# EAGLE design vehicle_control_module_0.1.0 (EAGLE 8.1.1)
DESCRIPTION: microOBD 200 OBD-II Module; HW_REV: 1.4; PCB_REV: C; PCB_SPEC1: Layer Count: 4; PCB_SPEC2: Size: 1.3" x 0.59"; PCB_SPEC3: Finish Thickness: 0.049" - 0.052"; PCB_SPEC4: Copper Weight: 1oz; TITLE: STM1120

## Sheet 1 of 2
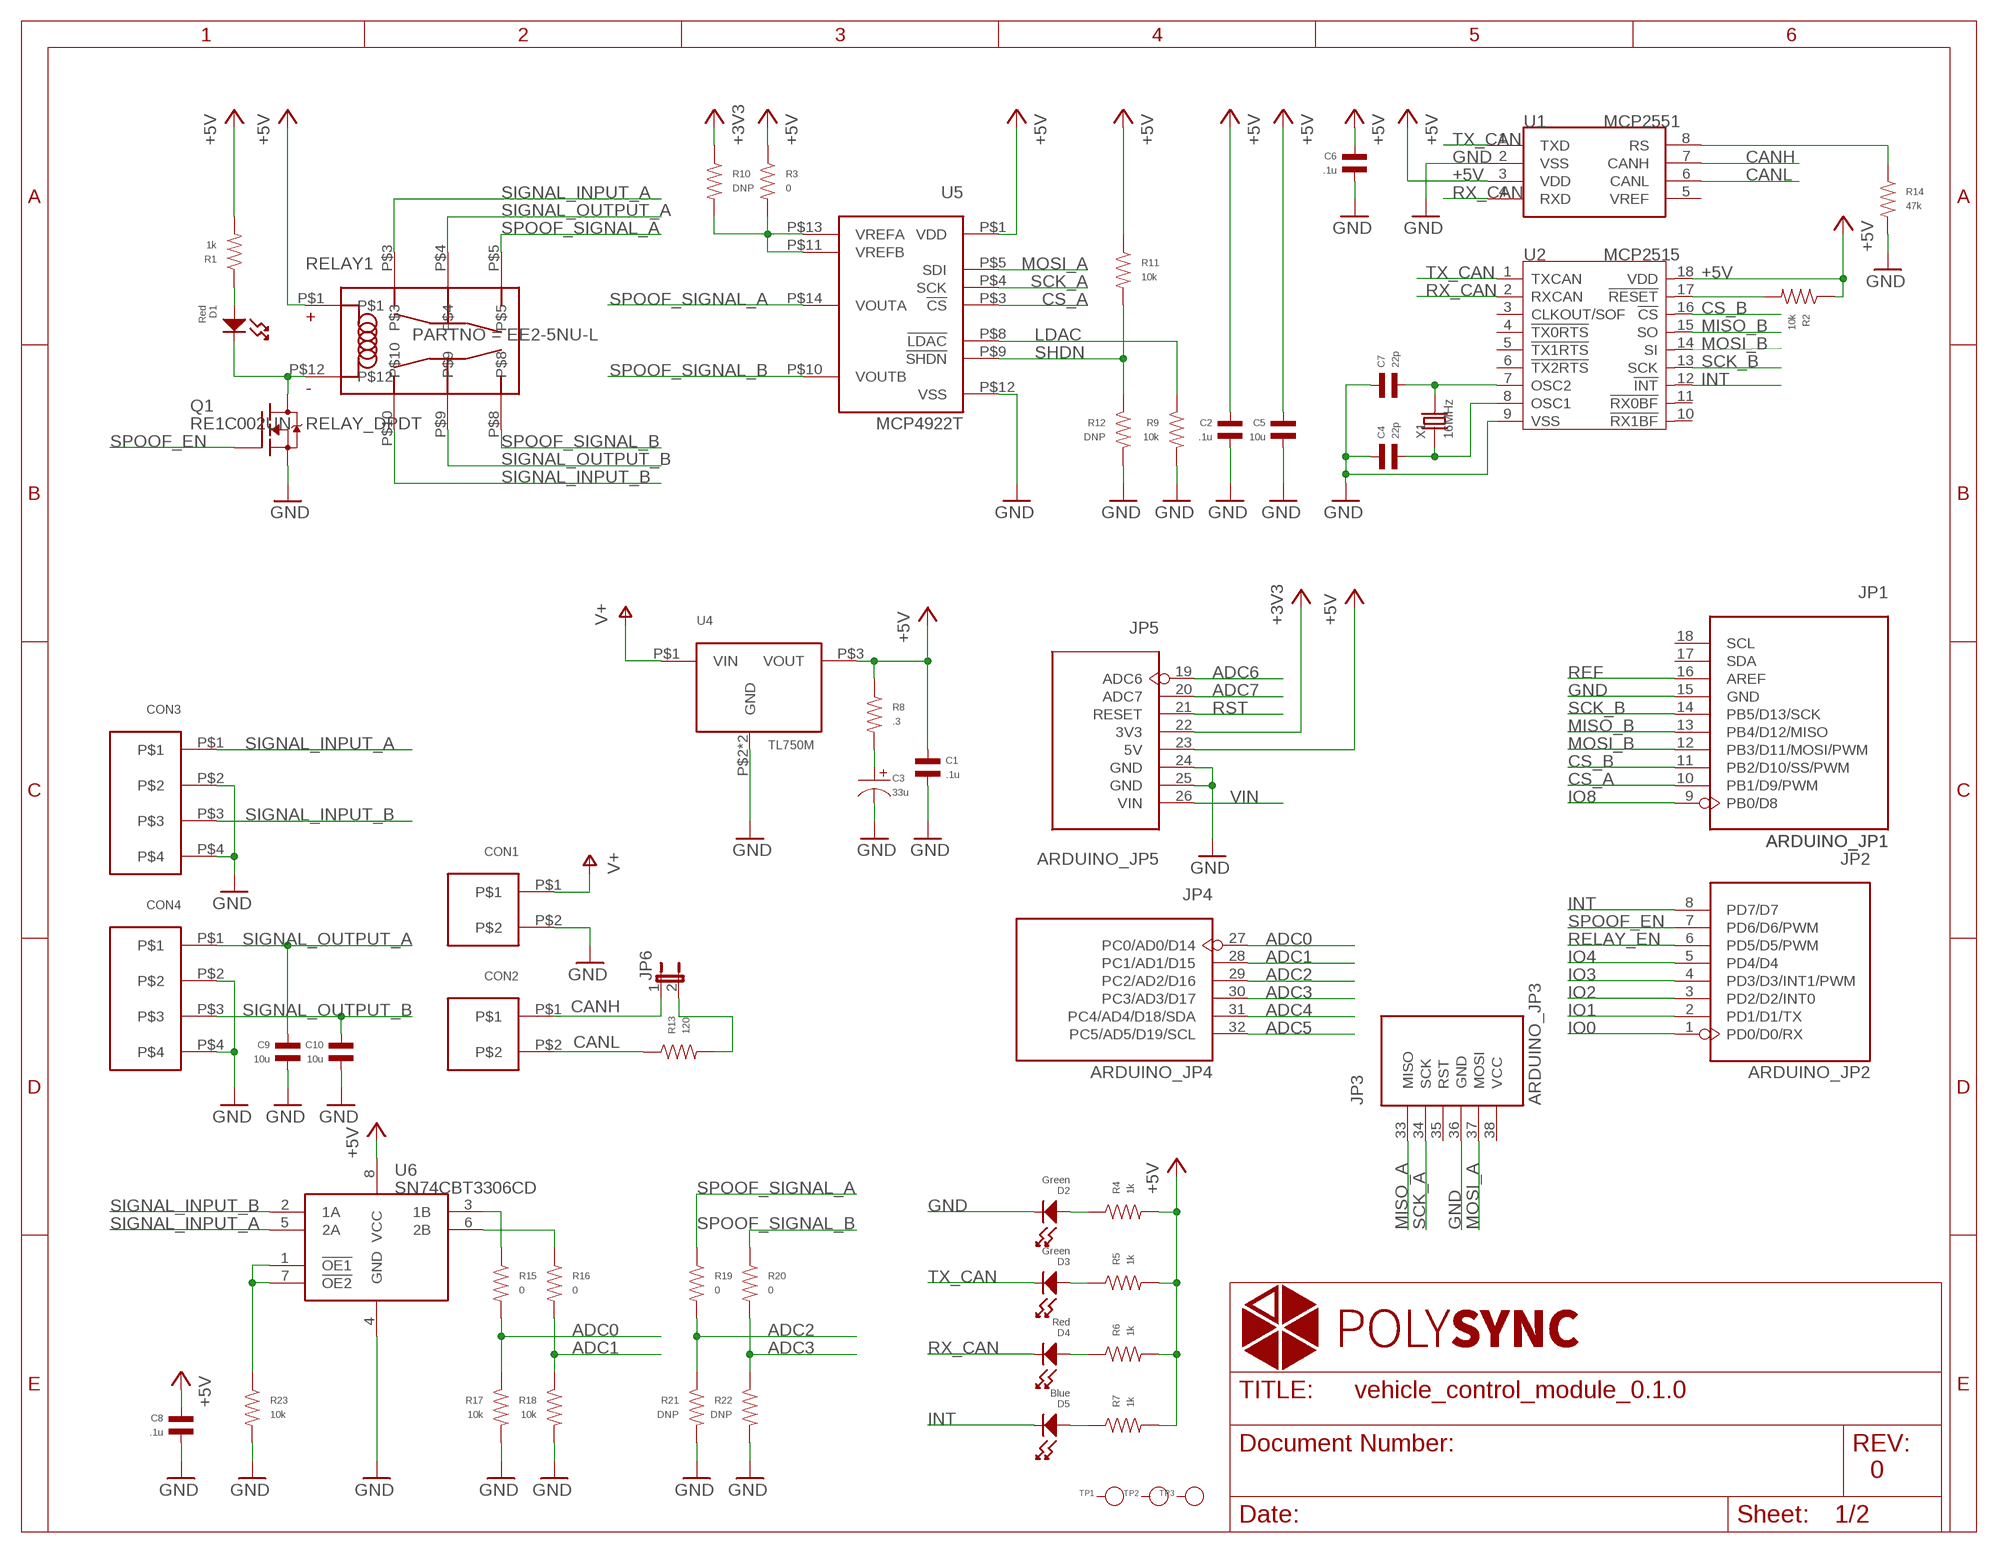
[diagram p0: schematic, sheet 1]

### Parts
C1  .1u  CAPACITOR_NP_0402  [C0402]
C2  .1u  CAPACITOR_NP_0402  [C0402]
C3  33u  CAPACITOR_P  [CP1206]
C4  22p  CAPACITOR_NP_0402  [C0402]
C5  10u  CAPACITOR_NP_0805  [C0805]
C6  .1u  CAPACITOR_NP_0402  [C0402]
C7  22p  CAPACITOR_NP_0402  [C0402]
C8  .1u  CAPACITOR_NP_0402  [C0402]
C9  10u  CAPACITOR_NP_0805  [C0805]
C10  10u  CAPACITOR_NP_0805  [C0805]
CON1  CON23.5MM  [PHOENIX_2_45]
CON2  CON23.5MM  [PHOENIX_2_45]
CON3  CON4  [PHOENIX_4_45]
CON4  CON4  [PHOENIX_4_45]
D1  Red  LED_SINGLE-0603  [LED0603]
D2  Green  LED_SINGLE-0603  [LED0603]
D3  Green  LED_SINGLE-0603  [LED0603]
D4  Red  LED_SINGLE-0603  [LED0603]
D5  Blue  LED_SINGLE-0603  [LED0603]
JP1  ARDUINO_JP1  [ARDUINO_JP1]
JP2  ARDUINO_JP2  [ARDUINO_JP2]
JP3  ARDUINO_JP3  [ARDUINO_JP3]
JP4  ARDUINO_JP4  [ARDUINO_JP4]
JP5  ARDUINO_JP5  [ARDUINO_JP5]
JP6  JP1E  [JP1]
Q1  RE1C002UN  [EMT3F]
R1  1k  RESISTOR_0402  [R0402]
R2  10k  RESISTOR_0402  [R0402]
R3  0  RESISTOR_0402  [R0402]
R4  1k  RESISTOR_0402  [R0402]
R5  1k  RESISTOR_0402  [R0402]
R6  1k  RESISTOR_0402  [R0402]
R7  1k  RESISTOR_0402  [R0402]
R8  .3  RESISTOR_0402  [R0402]
R9  10k  RESISTOR_0402  [R0402]
R10  DNP  RESISTOR_0402  [R0402]
R11  10k  RESISTOR_0402  [R0402]
R12  DNP  RESISTOR_0402  [R0402]
R13  120  RESISTOR_0402  [R0402]
R14  47k  RESISTOR_0402  [R0402]
R15  0  RESISTOR_0402  [R0402]
R16  0  RESISTOR_0402  [R0402]
R17  10k  RESISTOR_0402  [R0402]
R18  10k  RESISTOR_0402  [R0402]
R19  0  RESISTOR_0402  [R0402]
R20  0  RESISTOR_0402  [R0402]
R21  DNP  RESISTOR_0402  [R0402]
R22  DNP  RESISTOR_0402  [R0402]
R23  10k  RESISTOR_0402  [R0402]
RELAY1  RELAY_DPDT  [KEMET_EE2]
TP1  PAD-TEST-POINT'4545'  [TP_4545]
TP2  PAD-TEST-POINT'4545'  [TP_4545]
TP3  PAD-TEST-POINT'4545'  [TP_4545]
U1  MCP2551  MCP2551-SOIC8  [SOIC8-6.0]
U2  MCP2515  MCP2515-SOIC18  [SOIC18]
U4  TL750M  [TO-263]
U5  MCP4922T  [TSSOP-14]
U6  SN74CBT3306CD  [SOIC-8]
X1  16MHz  CRYSTAL-HC49UP  [HC49UP]

### Nets
+3V3: JP5.22(3V3) R10.P$1
+5V: C1.P$1 C2.P$1 C5.P$1 C6.P$1 C8.P$1 JP5.23(5V) R1.P$2 R2.P$1 R3.P$1 R4.P$2 R5.P$2 R6.P$2 R7.P$2 R8.P$1 R11.P$1 RELAY1.P$1 U1.3(VDD) U2.18(VDD) U4.P$3(VOUT) U5.P$1(VDD) U6.8(VCC) ; also sheet 2
ADC0: JP4.27(PC0/AD0/D14) R15.P$2 R17.P$1
ADC1: JP4.28(PC1/AD1/D15) R16.P$2 R18.P$1
ADC2: JP4.29(PC2/AD2/D16) R19.P$2 R21.P$1
ADC3: JP4.30(PC3/AD3/D17) R20.P$2 R22.P$1
ADC4: JP4.31(PC4/AD4/D18/SDA)
ADC5: JP4.32(PC5/AD5/D19/SCL)
ADC6: JP5.19(ADC6)
ADC7: JP5.20(ADC7)
CANH: CON2.P$1 JP6.1 U1.7(CANH)
CANL: CON2.P$2 R13.P$1 U1.6(CANL)
CS_A: JP1.10(PB1/D9/PWM) U5.P$3(!CS)
CS_B: JP1.11(PB2/D10/SS/PWM) U2.16(!CS)
GND: C1.P$2 C2.P$2 C3.P$2 C4.P$1 C5.P$2 C6.P$2 C7.P$1 C8.P$2 C9.P$2 C10.P$2 CON1.P$2 CON3.P$2 CON3.P$4 CON4.P$2 CON4.P$4 D2.CATHODE JP1.15(GND) JP3.36(GND) JP5.24(GND) JP5.25(GND) Q1.P$2(S) R9.P$2 R12.P$2 R14.P$2 R17.P$2 R18.P$2 R21.P$2 R22.P$2 R23.P$2 U1.2(VSS) U2.9(VSS) U4.P$2(GND) U4.P$4(GND) U5.P$12(VSS) U6.4(GND) ; also sheet 2
INT: D5.CATHODE JP2.8(PD7/D7) U2.12(!INT)
IO0: JP2.1(PD0/D0/RX)
IO1: JP2.2(PD1/D1/TX)
IO2: JP2.3(PD2/D2/INT0)
IO3: JP2.4(PD3/D3/INT1/PWM)
IO4: JP2.5(PD4/D4)
IO8: JP1.9(PB0/D8)
LDAC: R9.P$1 U5.P$8(!LDAC)
MISO_A: JP3.33(MISO)
MISO_B: JP1.13(PB4/D12/MISO) U2.15(SO)
MOSI_A: JP3.37(MOSI) U5.P$5(SDI)
MOSI_B: JP1.12(PB3/D11/MOSI/PWM) U2.14(SI)
N$1: D3.ANODE R5.P$1
N$2: JP6.2 R13.P$2
N$3: D1.CATHODE Q1.P$3(D) RELAY1.P$12
N$4: C3.P$1 R8.P$2
N$5: D4.ANODE R6.P$1
N$6: D2.ANODE R4.P$1
N$7: R3.P$2 R10.P$2 U5.P$11(VREFB) U5.P$13(VREFA)
N$8: D5.ANODE R7.P$1
N$9: R14.P$1 U1.8(RS)
N$10: D1.ANODE R1.P$1
N$11: R23.P$1 U6.1(!OE1) U6.7(!OE2)
N$12: R16.P$1 U6.6(2B)
N$13: R15.P$1 U6.3(1B)
N$16: C7.P$2 U2.7(OSC2) X1.2
N$17: C4.P$2 U2.8(OSC1) X1.1
REF: JP1.16(AREF)
RELAY_EN: JP2.6(PD5/D5/PWM) ; also sheet 2
RST: JP5.21(RESET)
RST_N: R2.P$2 U2.17(!RESET)
RX_CAN: D4.CATHODE U1.4(RXD) U2.2(RXCAN)
SCK_A: JP3.34(SCK) U5.P$4(SCK)
SCK_B: JP1.14(PB5/D13/SCK) U2.13(SCK)
SHDN: R11.P$2 R12.P$1 U5.P$9(!SHDN)
SIGNAL_INPUT_A: CON3.P$1 RELAY1.P$3 U6.5(2A)
SIGNAL_INPUT_B: CON3.P$3 RELAY1.P$10 U6.2(1A)
SIGNAL_OUTPUT_A: C9.P$1 CON4.P$1 RELAY1.P$4
SIGNAL_OUTPUT_B: C10.P$1 CON4.P$3 RELAY1.P$9
SPOOF_EN: JP2.7(PD6/D6/PWM) Q1.P$1(G)
SPOOF_SIGNAL_A: R19.P$1 RELAY1.P$5 U5.P$14(VOUTA)
SPOOF_SIGNAL_B: R20.P$1 RELAY1.P$8 U5.P$10(VOUTB)
TX_CAN: D3.CATHODE U1.1(TXD) U2.1(TXCAN)
V+: CON1.P$1 U4.P$1(VIN)
VIN: JP5.26(VIN)
Unconnected: JP1.17(SDA) JP1.18(SCL) JP3.35(RST) JP3.38(VCC) TP1.T TP2.T TP3.T U1.5(VREF) U2.3(CLKOUT/SOF) U2.4(!TX0RTS) U2.5(!TX1RTS) U2.6(!TX2RTS) U2.10(!RX1BF) U2.11(!RX0BF)

### Notes on the sheet
- 0

## Sheet 2 of 2
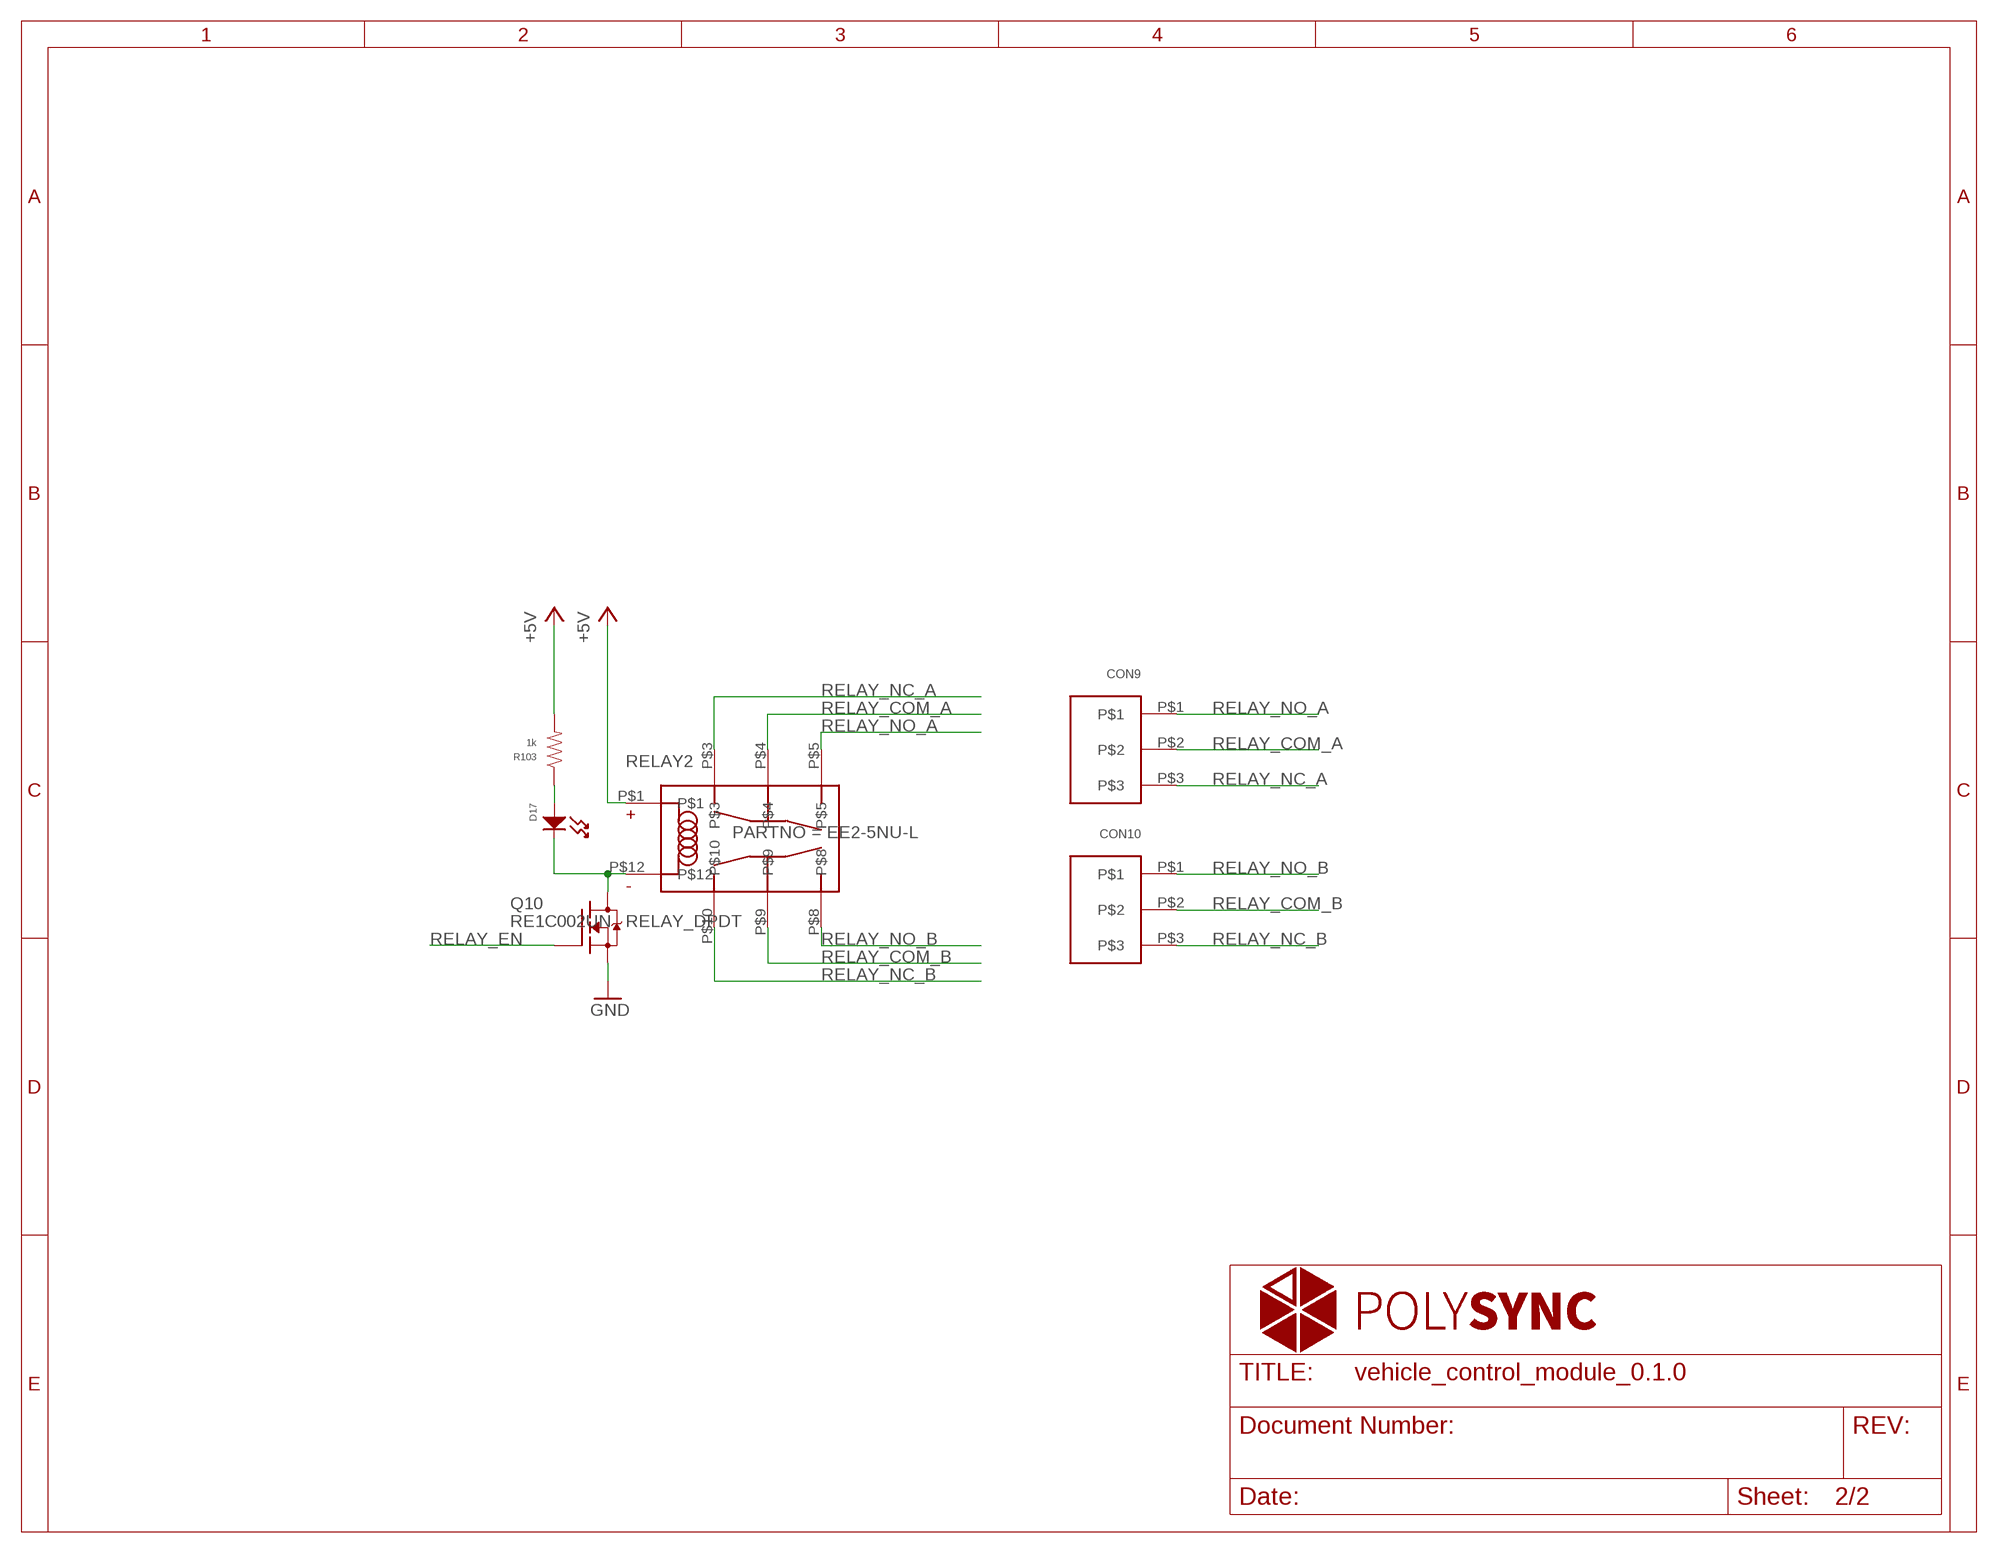
[diagram p1: schematic, sheet 2]

### Parts
CON9  CON3  [PHOENIX_3_45]
CON10  CON3  [PHOENIX_3_45]
D17  LED_SINGLE-0603  [LED0603]
Q10  RE1C002UN  [EMT3F]
R103  1k  RESISTOR_0402  [R0402]
RELAY2  RELAY_DPDT  [KEMET_EE2]

### Nets
+5V: R103.P$2 RELAY2.P$1 ; also sheet 1
GND: Q10.P$2(S) ; also sheet 1
N$25: D17.CATHODE Q10.P$3(D) RELAY2.P$12
N$34: D17.ANODE R103.P$1
RELAY_COM_A: CON9.P$2 RELAY2.P$4
RELAY_COM_B: CON10.P$2 RELAY2.P$9
RELAY_EN: Q10.P$1(G) ; also sheet 1
RELAY_NC_A: CON9.P$3 RELAY2.P$3
RELAY_NC_B: CON10.P$3 RELAY2.P$10
RELAY_NO_A: CON9.P$1 RELAY2.P$5
RELAY_NO_B: CON10.P$1 RELAY2.P$8

## Library data of the parts
C1 C2 C4-C10 = MF_Passives:CAPACITOR_NP: Library: MF_Passives Description: Device for Non-Polarized Capacitors. Manufacture part number (MPN) can be added via Attributes. Check https://factory.macrofab.com/parts for the house parts list.; POPULATE: 1
C3 = MF_Passives:CAPACITOR_P: Library: MF_Passives Description: Device for Polarized Capacitors. Manufacture part number (MPN), Voltage Rating, and Tolerance can be added via Attributes. Check https://factory.macrofab.com/parts for the house parts list.
CON1 CON2 = polysync:CON2
CON3 CON4 = polysync:CON4
CON9 CON10 = polysync:CON3
D1-D5 D17 = MF_LEDs:LED_SINGLE: Library: MF_LEDs Description: Device for Single LED Packages. Manufacture part number (MFG#) can be added via Attributes.; HOUSEPART: NO; POPULATE: 1
JP1 = polysync_steering_throttle:ARDUINO_JP1
JP2 = polysync_steering_throttle:ARDUINO_JP2
JP3 = polysync_steering_throttle:ARDUINO_JP3
JP4 = polysync_steering_throttle:ARDUINO_JP4
JP5 = polysync_steering_throttle:ARDUINO_JP5
JP6 = jumper:JP1E: JUMPER
Q1 Q10 = BTLE_widget:RE1C002UN
R1-R23 R103 = MF_Passives:RESISTOR: Library: MF_Passives Description: Device for Resistors. Manufacture part number (MPN), Voltage, Tolerance, and Wattage Rating can be added via Attributes. Check https://factory.macrofab.com/parts for the house parts list.; POPULATE: 1
RELAY1 RELAY2 = polysync:RELAY_DPDT; PARTNO: EE2-5NU-L
TP1-TP3 = Discrete:PAD-TEST-POINT; PARTNO: DNP
U1 = IC:MCP2551: High-Speed CAN Transceiver http://ww1.microchip.com/downloads/en/devicedoc/21667f.pdf
U2 = IC:MCP2515: Stand-Alone CAN Controller With SPI Interface
U4 = polysync:TL750M
U5 = polysync:MCP4922T
U6 = polysync:SN74CBT3306CD
X1 = Discrete:CRYSTAL*: CRYSTAL

## Net classes
0 default: width 0.152 mm, drill 0.305 mm, clearance 0.152 mm

## Board
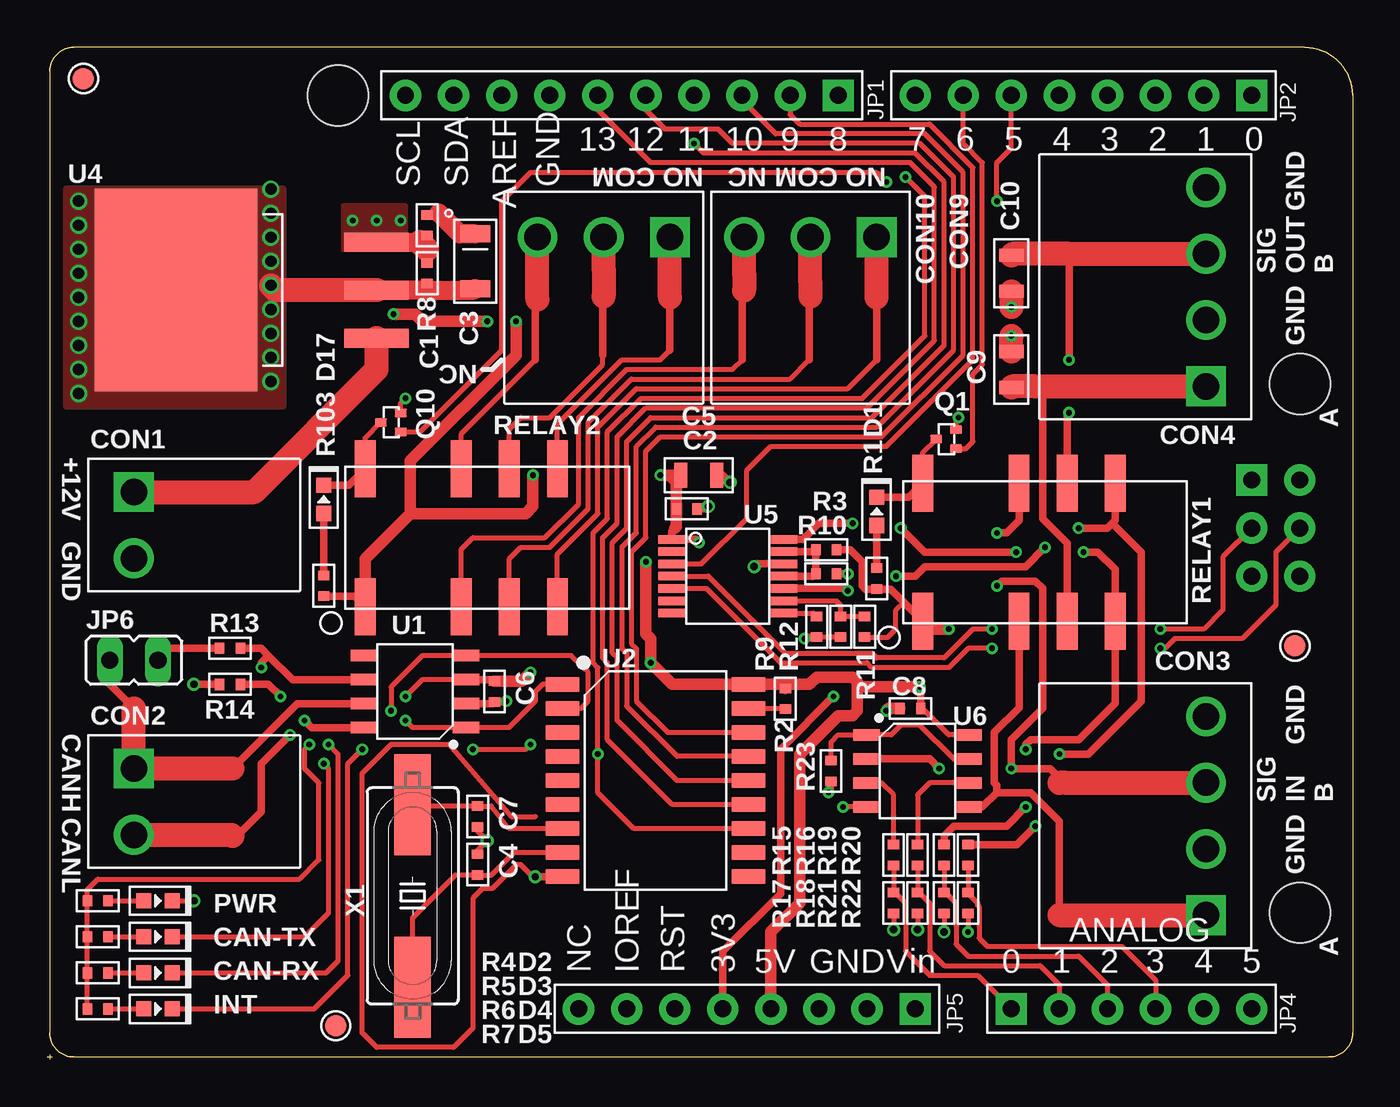
[diagram p2: board, top side]
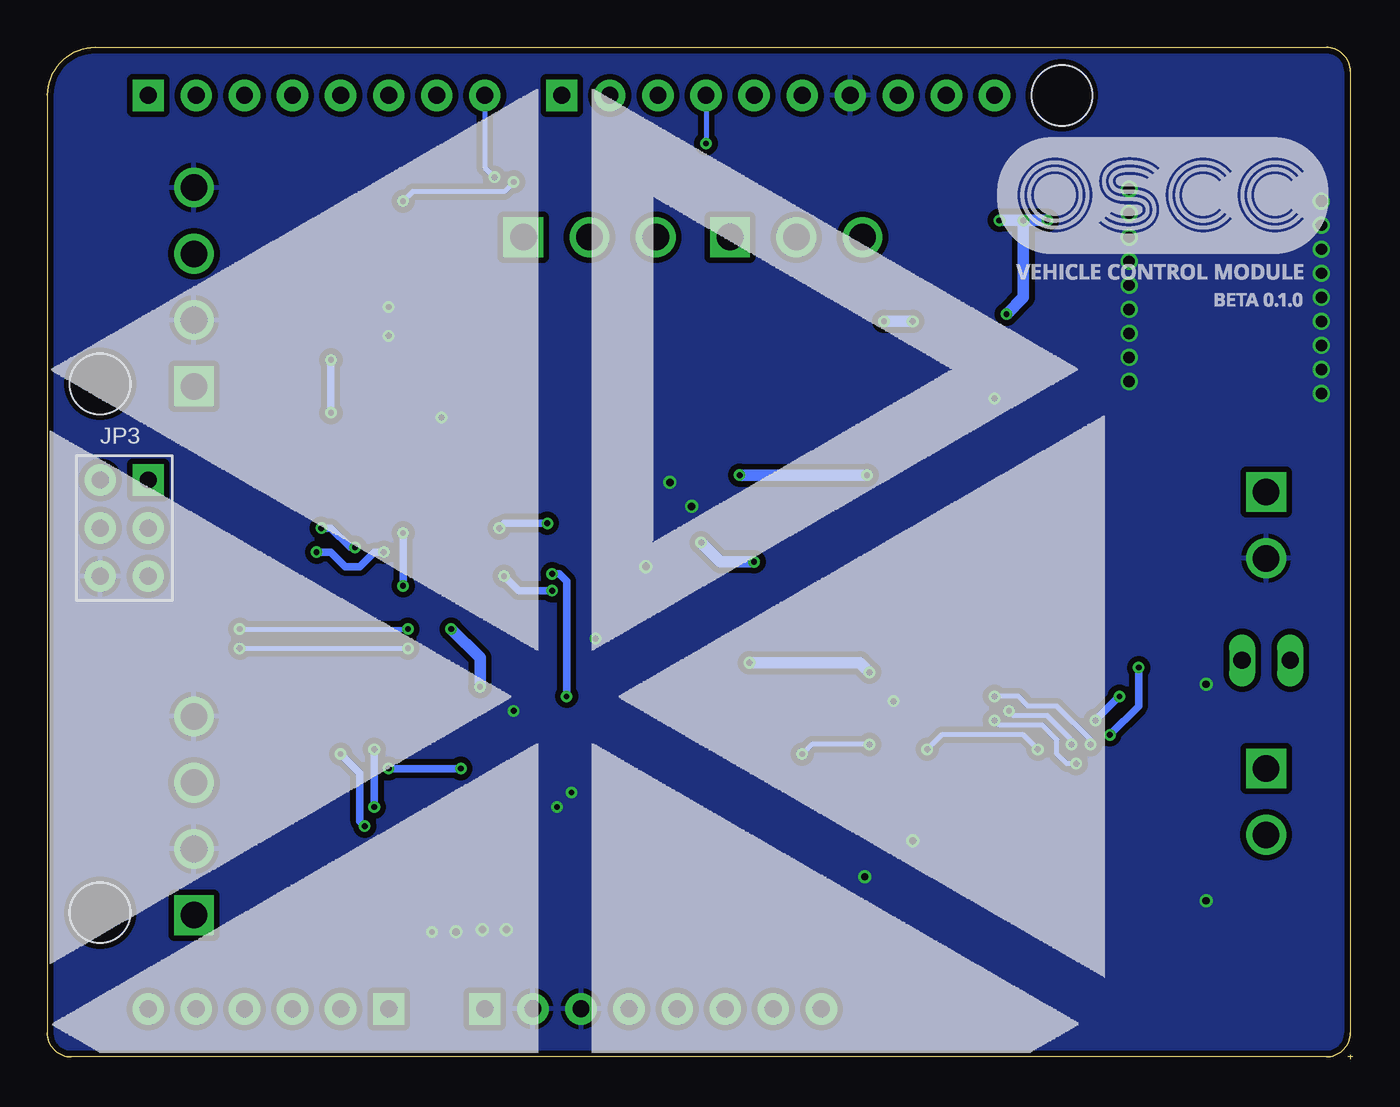
[diagram p3: board, bottom side, seen from below]

Size 68.96 x 53.47 mm. Coordinates in mm from the lower left corner, seen from the top.
Outline: 68.96,1.4 arc-90 67.69,0.13
Outline: 1.4,0.13 arc-90 0.13,1.4
Outline: 0.13,52.2 arc-90 1.4,53.47
Outline: 66.42,53.47 arc-90 68.96,50.93
Outline: 0.13,1.4 arc90 1.4,0.13
Outline: 67.69,0.13 arc90 68.96,1.4
Outline: 1.4,53.47 arc90 0.13,52.2
Outline: 0.13,1.4 arc90 1.4,0.13
Outline: 67.69,0.13 arc90 68.96,1.4
Outline: 68.96,50.93 arc90 66.42,53.47
Outline: 68.96,1.4 arc-90 67.69,0.13
Outline: 66.42,53.47 1.4,53.47
Outline: 1.4,53.47 arc90 0.13,52.2
Outline: 0.13,52.2 0.13,1.4
Outline: 0.13,1.4 arc90 1.4,0.13
Outline: 68.96,50.93 arc90 66.42,53.47
Outline: 1.4,0.13 67.69,0.13
Outline: 0,0.13 0.25,0.13
Outline: 0.13,0.25 0.13,0
Outline: 68.96,50.93 68.96,1.4
Copper layers (1*16): Top 0.035mm / dielectric 1.5mm / Bottom 0.035mm
Design rules "MF_Standard_2_Layer": minimum track width 6mil, minimum drill 12mil, track to track 6mil, track to pad 6mil, pad to pad 6mil, via to via 6mil, smd to smd 0mil, copper to edge 10mil, drill to drill 10mil, minimum pad ring 6mil, minimum via ring 6mil, stop-mask expansion 2mil, vias tented up to drill 25mil, thermal gap 10mil

### Footprints (pad centres in the part's own frame; a part is rotated, then mirrored left to right if it is on the bottom)
C0402 = smd 0.5 x 0.6: P$1 -0.55,0; P$2 0.55,0
CP1206 = smd 0.9 x 1.6: P$1 -1.45,0; P$2 1.45,0
C0805 = smd 0.7 x 1.3: P$1 -0.95,0; P$2 0.95,0
PHOENIX_2_45 = drill 1.4 square: P$1 0,0 | drill 1.4: P$2 3.5,0
PHOENIX_4_45 = drill 1.4 square: P$1 0,0 | drill 1.4: P$2 3.5,0; P$3 7,0; P$4 10.5,0
PHOENIX_3_45 = drill 1.4 square: P$1 0,0 | drill 1.4: P$2 3.5,0; P$3 7,0
LED0603 = smd 0.8 x 0.8: ANODE 0.75,0; CATHODE -0.75,0
ARDUINO_JP1 = drill 0.889 pad 1.651 square: 9 41.656,50.8 | drill 0.889 pad 1.651: 10 39.116,50.8; 11 36.576,50.8; 12 34.036,50.8; 13 31.496,50.8; 14 28.956,50.8; 15 26.416,50.8; 16 23.876,50.8; 17 21.336,50.8; 18 18.796,50.8 | hole 3.2: 15.24,50.8
ARDUINO_JP2 = drill 0.889 pad 1.651 square: 1 63.5,50.8 | drill 0.889 pad 1.651: 2 60.96,50.8; 3 58.42,50.8; 4 55.88,50.8; 5 53.34,50.8; 6 50.8,50.8; 7 48.26,50.8; 8 45.72,50.8
ARDUINO_JP3 = drill 0.889 pad 1.651 square: 33 63.5,30.48 | drill 0.889 pad 1.651: 34 63.5,27.94; 35 63.5,25.4; 36 66.04,25.4; 37 66.04,27.94; 38 66.04,30.48 | hole 3.2: 66.04,35.56; 66.04,7.62
ARDUINO_JP4 = drill 0.889 pad 1.651 square: 27 50.8,2.54 | drill 0.889 pad 1.651: 28 53.34,2.54; 29 55.88,2.54; 30 58.42,2.54; 31 60.96,2.54; 32 63.5,2.54
ARDUINO_JP5 = drill 0.889 pad 1.651: 19 27.94,2.54; 20 30.48,2.54; 21 33.02,2.54; 22 35.56,2.54; 23 38.1,2.54; 24 40.64,2.54; 25 43.18,2.54 | drill 0.889 pad 1.651 square: 26 45.72,2.54
JP1 = drill 0.914 long: 1 0,-1.27; 2 0,1.27
EMT3F = smd 0.46 x 0.65: P$1 -0.5,0; P$2 0.5,0; P$3 0,1.05
R0402 = smd 0.5 x 0.6: P$1 -0.55,0; P$2 0.55,0
KEMET_EE2 = smd 1.1 x 3: P$1 -6.45,-3.645; P$3 -1.37,-3.645; P$4 1.17,-3.645; P$5 3.71,-3.645; P$8 3.71,3.645; P$9 1.17,3.645; P$10 -1.37,3.645; P$12 -6.45,3.645
TP_4545 = smd 1.143 x 1.143: T 0,0
SOIC8-6.0 = smd 0.6 x 1.4: 1 -1.905,-2.7; 2 -0.635,-2.7; 3 0.635,-2.7; 4 1.905,-2.7; 5 1.905,2.7; 6 0.635,2.7; 7 -0.635,2.7; 8 -1.905,2.7
SOIC18 = smd 0.762 x 1.778: 1 -5.08,-4.915; 2 -3.81,-4.915; 3 -2.54,-4.915; 4 -1.27,-4.915; 5 0,-4.915; 6 1.27,-4.915; 7 2.54,-4.915; 8 3.81,-4.915; 9 5.08,-4.915; 10 5.08,4.915; 11 3.81,4.915; 12 2.54,4.915; 13 1.27,4.915; 14 0,4.915; 15 -1.27,4.915; 16 -2.54,4.915; 17 -3.81,4.915; 18 -5.08,4.915
TO-263 = smd 1 x 3.4: P$1 -2.54,0; P$2 0,0; P$3 2.54,0 | smd 10.7 x 8.6: P$4 0,10.6
TSSOP-14 = smd 1.45 x 0.45: P$1 -2.95,1.95; P$2 -2.95,1.3; P$3 -2.95,0.65; P$4 -2.95,0; P$5 -2.95,-0.65; P$6 -2.95,-1.3; P$7 -2.95,-1.95; P$8 2.95,-1.95; P$9 2.95,-1.3; P$10 2.95,-0.65; P$11 2.95,0; P$12 2.95,0.65; P$13 2.95,1.3; P$14 2.95,1.95
SOIC-8 = smd 0.6 x 1.4: 1 -1.905,-2.7; 2 -0.635,-2.7; 3 0.635,-2.7; 4 1.905,-2.7; 5 1.905,2.7; 6 0.635,2.7; 7 -0.635,2.7; 8 -1.905,2.7
HC49UP = smd 5.334 x 1.93: 1 -4.826,0; 2 4.826,0

### Placement (x,y rotation side)
C1  20.07,41.53 270 top
C2  33.78,29.08 0 top
C3  22.61,42.16 270 top
C4  22.73,10.29 270 top
C5  34.42,30.86 0 top
C6  23.62,19.43 270 top
C7  22.73,12.83 90 top
C8  45.59,18.54 180 top
C9  50.93,36.45 90 top
C10  50.93,41.53 270 top
CON1  4.57,29.97 270 top
CON2  4.57,15.37 270 top
CON3  61.21,7.62 90 top
CON4  61.21,35.56 90 top
CON9  43.82,43.43 180 top
CON10  32.89,43.43 180 top
D1  43.82,28.96 270 top
D2  5.84,8.38 180 top
D3  5.84,6.48 180 top
D4  5.84,4.57 180 top
D5  5.84,2.67 180 top
D17  14.61,29.59 270 top
JP1  0.13,0.13 0 top
JP2  0.13,0.13 0 top
JP3  0.13,0.13 0 top
JP4  0.13,0.13 0 top
JP5  0.13,0.13 0 top
JP6  4.57,21.08 270 top
Q1  48.01,32.77 90 top
Q10  18.67,33.66 90 top
R1  43.82,25.4 270 top
R2  38.99,19.05 270 top
R3  41.15,26.92 180 top
R4  2.67,8.38 180 top
R5  2.67,6.48 180 top
R6  2.67,4.57 180 top
R7  2.67,2.67 180 top
R8  20.07,44.07 90 top
R9  40.64,22.86 270 top
R10  41.15,25.65 180 top
R11  43.18,22.86 90 top
R12  41.91,22.86 270 top
R13  9.65,21.72 180 top
R14  9.65,19.81 180 top
R15  44.7,10.79 270 top
R16  45.97,10.79 270 top
R17  44.7,8.26 270 top
R18  45.97,8.26 270 top
R19  47.37,10.79 270 top
R20  48.64,10.79 270 top
R21  47.37,8.26 270 top
R22  48.64,8.26 270 top
R23  41.4,15.24 270 top
R103  14.61,25.02 270 top
RELAY1  52.71,26.8 0 top
RELAY2  23.24,27.56 0 top
TP1  15.24,1.78 0 top
TP2  65.91,21.84 0 top
TP3  1.91,51.82 0 top
U1  19.43,19.43 90 top
U2  32.13,14.73 270 top
U4  17.4,40.64 90 top
U5  35.94,25.53 0 top
U6  45.97,15.24 270 top
U$1  [POLYSYNC_STEERING_BOT]  0.64,0.38 0 top
U$5  [POLYSYNC_VEHICLE_CONTROL_0_1_0]  18.92,38.99 0 bottom
X1  19.3,8.64 90 top

### Tracks (layer width: path | path; a pad name or v marks a point on that pad's centre or on a via)
+3V3  (via drill 0.3)
  Top 0.406: R10.P$1 v42.29,25.65 | JP5.22 35.69,5.71 38.73,8.76 38.73,16.38 v41.53,19.18
  Bottom 0.406: v42.29,25.65 41.91,25.65 41.53,25.27 v41.53,19.18
+5V  (via drill 0.3)
  Top 0.254: C1.P$1 20.07,42.8 | R8.P$1 20.02,43.52 19.68,43.18 | R7.P$2 R6.P$2 R5.P$2 R4.P$2 2.12,8.98 2.67,9.53 13.34,9.53 14.35,10.54 14.35,14.61 13.59,15.37 13.59,16.38 v13.84,16.64 | C8.P$1 46.23,18.54 47.62,17.14 U6.8 | U1.3 19.81,20.07 v18.92,19.18 | R11.P$1 44.41,22.31 44.83,22.73 44.83,23.75 45.24,24.16
  Top 0.406: U1.3 23.54,20.07 C6.P$1 | R103.P$2 16.24,24.47 RELAY2.P$1 | RELAY1.P$1 45.24,24.16 44.56,24.85 R1.P$2 43.22,24.85 43.05,25.02 43.05,26.29 42.42,26.92 R3.P$1 | v34.42,27.3 34.25,27.48 U5.P$1 32.99,27.91 33.15,28.07 | 42.8,19.94 43.05,19.68 | v46.1,19.68 46.14,19.64 C8.P$1
  Top 0.61: JP5.23 38.23,6.73 39.75,8.26 39.75,16.13 41.78,18.16 42.55,18.16 42.8,18.41 42.8,19.94 42.55,20.19 40.64,20.19 40.26,19.81 38.99,19.81 | 38.99,19.81 U2.18 33.02,19.81 v31.88,20.95 31.88,22.22 31.62,22.48 v31.62,26.29 | C6.P$1 25.06,19.98 v25.53,20.45 | R2.P$1 38.99,19.81 | 33.15,28.07 33.23,28.15 C2.P$1 33.23,30.52 32.89,30.86 | 32.89,30.86 C5.P$1 | 32.89,30.86 v32.39,30.86 | v25.65,30.86 25.65,29.21 25.27,28.83 19.18,28.83 | RELAY2.P$1 16.79,26.44 19.18,28.83 | 19.18,28.83 19.18,31.62 24.77,37.21 v24.77,38.99 | v23.24,38.99 19.81,38.99 19.43,39.37 v18.29,39.37 | v46.1,19.68 43.05,19.68 | v47.62,22.73 46.67,22.73 RELAY1.P$1
  Top 1.016: U4.P$3 19.68,43.18
  Top 1.27: 19.68,43.18 20.07,42.8
  Bottom 0.254: v13.84,16.64 13.84,16.89 15.62,18.67 17.14,18.67 17.65,19.18 v18.92,19.18
  Bottom 0.61: v31.88,20.95 26.04,20.95 v25.53,20.45 | v31.62,26.29 33.4,26.29 v34.42,27.3 | v32.39,30.86 v25.65,30.86 | v24.77,38.99 v23.24,38.99 | v16.13,44.32 v17.4,44.32 | v17.4,44.32 v18.67,44.32 | v17.4,44.32 17.4,40.26 v18.29,39.37 | v46.1,19.68 46.1,21.21 v47.62,22.73
  pour Top (isolate 0.305, no thermals): 15.88,42.8 18.92,42.8 18.92,45.09 15.62,45.09 15.62,42.8
ADC0
  Top 0.254: R15.P$2 R17.P$1 44.79,8.81 45.34,8.26 45.34,5.71 46.61,4.44 49.15,4.44 JP4.27
ADC1
  Top 0.254: R16.P$2 R18.P$1 46.06,8.81 46.61,8.26 46.61,5.71 47.37,4.95 52.45,4.95 53.47,3.94 JP4.28
ADC2
  Top 0.254: R19.P$2 R21.P$1 47.46,8.81 48.01,8.26 48.01,6.1 48.64,5.46 54.48,5.46 56.01,3.94 JP4.29
ADC3
  Top 0.254: R20.P$2 R22.P$1 48.64,8.76 49.15,8.26 49.15,8.14 49.23,8.07 49.23,6.4 49.66,5.97 56.77,5.97 58.55,4.19 JP4.30
CANH
  Top 0.406: JP6.1 3.3,19.81 4.57,18.54 | U1.7 13.21,18.8 9.78,15.37
  Top 1.27: 4.57,18.54 CON2.P$1 9.78,15.37
CANL  (via drill 0.3)
  Top 0.406: U1.6 12.95,20.07 11.68,21.34 | 11.68,21.34 11.3,21.72 R13.P$1 | 9.72,11.87 10.09,11.87 11.3,13.08 11.3,15.62 v12.83,17.14 | v11.3,20.7 11.3,20.95 11.68,21.34
  Top 1.27: CON2.P$2 9.72,11.87 9.78,11.81
  Bottom 0.406: v12.83,17.14 11.3,18.67 v11.3,20.7
CS_A
  Top 0.254: JP1.10 39.24,49.91 39.75,49.4 46.61,49.4 48.9,47.12 48.9,36.96 44.32,32.39 38.23,32.39 36.96,31.11 36.96,28.57 34.56,26.18 U5.P$3
CS_B
  Top 0.254: JP1.11 36.7,50.67 38.48,48.9 46.36,48.9 48.39,46.86 48.39,37.21 44.07,32.89 32.39,32.89 31.62,32.13 31.62,27.56 30.86,26.8 30.86,21.97 31.11,21.72 31.11,18.92 32.77,17.27 U2.16
GND  (via drill 0.3, 0.38, 0.6)
  Top 0.254: C1.P$2 20.07,40.64 | D2.CATHODE v7.75,8.38 | R12.P$2 R9.P$2 | R18.P$2 v45.97,6.86 | R17.P$2 v44.7,6.86 | C7.P$1 22.73,12.07 v23.24,11.56 22.73,11.05 C4.P$1 | v25.78,9.65 25.65,9.65 25.02,10.29 24.77,10.29 23.49,9.02 22.99,9.02 22.48,8.51 22.48,1.65 21.46,0.64 17.4,0.64 16.64,1.4 16.64,15.11 18.16,16.64 21.21,16.64 24.51,12.83 25.78,12.83 | R21.P$2 v47.37,6.73 | R22.P$2 v48.64,6.73 | Q1.P$2 48.01,33.78 v48.13,33.91 | U6.4 v42.04,13.34 | R23.P$2 41.4,14.22 v41.28,14.1 | Q10.P$2 18.67,34.67 v18.92,34.93
  Top 0.406: R14.P$2 v7.75,19.81 | U2.9 v25.78,9.65 | U5.P$12 37.48,26.18 v37.34,26.04 | C2.P$2 34.8,29.08 v34.93,29.21 | C5.P$2 35.69,30.86 v36.07,30.48 | U1.2 23.54,18.8 C6.P$2 24.21,18.88 v24.26,18.92 | R9.P$2 40.09,22.31 v40.01,22.22
  Top 0.61: C8.P$2 44.45,18.54 v44.32,18.41
  Top 1.016: U4.P$2 20.07,40.64 22.53,40.64 C3.P$2
  Top 1.27: C9.P$2 v50.93,38.23 | C10.P$2 v50.93,39.75 | U4.P$2 12.07,40.64 v11.81,40.89
  other vias: 1.65,36.45 1.65,37.72 1.65,38.99 1.65,40.26 1.65,41.53 1.65,42.8 1.65,44.07 1.65,45.34 11.81,35.81 11.81,37.08 11.81,38.35 11.81,39.62 11.81,42.16 11.81,43.43 11.81,44.7 11.81,45.97 1.65,35.18
  pour Bottom (isolate 0.305): 0.13,53.47 0.13,0.13 68.96,0.13 68.96,53.47
  pour Top (no thermals): 12.45,34.54 12.45,45.97 1.02,45.97 1.02,34.54
INT  (via drill 0.3)
  Top 0.254: U2.12 30.99,12.19 29.08,14.1 v29.08,16.13 29.08,20.7 28.83,20.95 28.83,27.81 29.59,28.57 29.59,33.15 31.37,34.93 43.05,34.93 46.36,38.23 46.36,45.59 v45.34,46.61 | D5.CATHODE 14.1,2.67 15.88,4.44 15.88,15.62 v16.64,16.38 | v22.48,16.38 25.27,16.38 v25.53,16.64
  Bottom 0.254: v16.64,16.38 17.4,17.14 21.72,17.14 v22.48,16.38 | v29.08,16.13 28.57,16.64 v25.53,16.64 | JP2.8 45.85,47.12 v45.34,46.61
LDAC
  Top 0.254: U5.P$8 40.47,23.58 R9.P$1
MISO_B
  Top 0.254: JP1.13 31.62,50.16 32.64,49.15 35.43,49.15 36.2,48.39 46.1,48.39 47.88,46.61 47.88,37.47 43.82,33.4 32.13,33.4 31.11,32.39 31.11,27.81 30.35,27.05 30.35,21.72 30.61,21.46 30.61,18.67 33.27,16 U2.15
MOSI_A  (via drill 0.3)
  Top 0.254: JP3.37 64.9,26.8 64.9,24 63.12,22.22 59.56,22.22 59.05,21.72 v58.8,21.72 | v49.91,21.72 48.64,21.72 47.62,20.7 43.56,20.7 43.31,20.95 38.73,20.95 34.81,24.88 U5.P$5
  Bottom 0.254: v58.8,21.72 v49.91,21.72
MOSI_B  (via drill 0.3)
  Top 0.254: U2.14 33.27,14.73 30.1,17.91 30.1,21.21 29.84,21.46 29.84,27.3 30.61,28.07 30.61,32.64 31.88,33.91 43.56,33.91 47.37,37.72 47.37,46.36 45.85,47.88 34.67,47.88 v34.16,48.39
  Bottom 0.254: JP1.12 v34.16,48.39
N$1
  Top 0.254: R5.P$1 D3.ANODE
N$2
  Top 0.406: R13.P$2 6.48,21.72 JP6.2
N$3
  Top 0.254: RELAY1.P$12 46.26,32.06 Q1.P$3
  Top 0.406: D1.CATHODE 45.52,29.71 RELAY1.P$12
N$4
  Top 0.254: 20.7,44.7 20.15,44.7 R8.P$2
  Top 1.016: C3.P$1 21.79,43.61 20.7,44.7
N$5
  Top 0.254: R6.P$1 D4.ANODE
N$6
  Top 0.254: R4.P$1 D2.ANODE
N$7
  Top 0.406: U5.P$11 40.47,25.53 R10.P$2 R3.P$2 40.5,26.83 U5.P$13
N$8
  Top 0.254: R7.P$1 D5.ANODE
N$9  (via drill 0.3)
  Top 0.406: U1.8 13.97,17.53 v13.59,17.91 | R14.P$1 11.68,19.81 v12.32,19.18
  Bottom 0.406: v13.59,17.91 v12.32,19.18
N$10
  Top 0.406: D1.ANODE R1.P$1
N$11
  Top 0.254: U6.7 47.88,15.88 46.1,17.65 45.09,17.65 44.58,17.14 U6.1 41.78,17.14 41.4,16.76 R23.P$1
N$12
  Top 0.254: U6.6 46.61,14.61 45.97,13.97 R16.P$1
N$13
  Top 0.254: R15.P$1 44.7,13.97 44.07,14.61 U6.3
N$16
  Top 0.254: U2.7 24.38,12.19 23.45,13.38 C7.P$2 19.39,13.38 X1.2
N$17
  Top 0.254: U2.8 24.64,10.92 23.45,9.74 C4.P$2 21.55,9.74 19.3,7.49 X1.1
N$25
  Top 0.254: RELAY2.P$12 16.79,32.83 Q10.P$3
  Top 0.406: D17.CATHODE 15.93,30.34 RELAY2.P$12
N$34
  Top 0.406: R103.P$1 D17.ANODE
RELAY_COM_A
  Top 0.254: RELAY2.P$4 24.41,26.44 25.02,27.05 26.54,27.05 28.57,29.08 28.57,33.66 30.86,35.94 39.24,35.94 40.26,36.96
  Top 0.406: 40.26,36.96 40.26,40.97 40.32,41.02
  Top 1.27: CON9.P$2 40.32,41.02 40.32,40.32
RELAY_COM_B
  Top 0.254: RELAY2.P$9 24.41,33.3 25.02,33.91 26.54,33.91 29.34,36.7 29.34,37.21
  Top 0.406: 29.34,37.21 29.34,41.73 29.39,41.78
  Top 1.27: CON10.P$2 29.39,41.78 29.39,40.32
RELAY_EN  (via drill 0.3)
  Top 0.254: Q10.P$1 19.69,33.16 24,37.47 24,45.34 25.53,46.86 43.82,46.86 v44.32,46.36 | v50.16,45.34 50.16,47.37 50.93,48.13 JP2.6
  Bottom 0.254: v44.32,46.36 44.83,45.85 49.66,45.85 v50.16,45.34
RELAY_NC_A
  Top 0.254: RELAY2.P$3 21.87,26.95 22.48,27.56 26.29,27.56 28.07,29.34 28.07,33.91 30.61,36.45 36.2,36.45 36.7,36.96
  Top 0.406: 36.7,36.96 36.7,41.42 36.82,41.53
  Top 1.27: CON9.P$3 36.82,41.53 36.82,40.62
RELAY_NC_B
  Top 0.254: RELAY2.P$10 21.87,33.05 25.78,36.96
  Top 0.406: 25.78,36.96 25.78,40.04 25.89,40.15
  Top 1.27: 25.89,40.15 CON10.P$3
RELAY_NO_A
  Top 0.254: RELAY2.P$5 26.95,26.7 29.08,28.83 29.08,33.15 29.08,33.4 31.11,35.43 42.29,35.43 43.82,36.96
  Top 0.406: 43.82,36.96 43.82,40.26
  Top 1.27: 43.82,40.26 CON9.P$1
RELAY_NO_B
  Top 0.254: RELAY2.P$8 26.95,33.55 30.35,36.96 32.39,36.96 32.89,37.47
  Top 0.406: 32.89,37.47 32.89,40.26
  Top 1.27: 32.89,40.26 CON10.P$1
RST_N
  Top 0.254: U2.17 38.95,18.54 R2.P$2
RX_CAN  (via drill 0.3)
  Top 0.254: U2.2 28.19,18.54 28.57,18.92 28.57,20.45 28.32,20.7 28.19,20.83 | 28.19,20.83 28.07,20.95 | 28.19,20.83 27.69,21.34 U1.4 19.81,21.34 18.16,19.68 v18.16,18.41 | D4.CATHODE 14.73,4.57 15.37,5.21 15.37,16.13 v14.86,16.64
  Bottom 0.254: v14.86,16.64 14.86,16.89 16.13,18.16 17.91,18.16 v18.16,18.41
SCK_A  (via drill 0.3)
  Top 0.254: JP3.34 62.1,26.54 62.1,23.75 61.09,22.73 v58.8,22.73 | v49.91,22.73 48.9,22.73 47.37,21.21 43.82,21.21 43.56,21.46 38.99,21.46 34.93,25.53 U5.P$4
  Bottom 0.254: v58.8,22.73 v49.91,22.73
SCK_B
  Top 0.254: JP1.14 29.08,50.16 31.88,47.37 45.59,47.37 46.86,46.1 46.86,37.97 43.31,34.42 31.62,34.42 30.1,32.89 30.1,28.32 29.34,27.56 29.34,21.21 29.59,20.95 29.59,16.89 33.02,13.46 U2.13
SHDN
  Top 0.254: U5.P$9 41.69,24.23 41.91,24 R12.P$1 R11.P$2
SIGNAL_INPUT_A
  Top 0.406: U6.5 49.4,13.34 50.16,14.1 | 50.16,14.1 51.94,14.1 53.47,12.57 53.47,7.62 | RELAY1.P$3 51.34,18.57 50.04,17.27 50.04,14.61 50.16,14.48 50.16,14.1
  Top 1.27: 53.47,7.62 CON3.P$1
SIGNAL_INPUT_B  (via drill 0.3)
  Top 0.406: U6.2 46.61,15.88 v47.12,15.37 | 53.74,14.62 52.99,15.37 v50.93,15.37 50.93,16.89 52.58,18.54 52.58,24.89 52.2,25.27 50.42,25.27 v50.16,25.02 | v50.16,27.81 50.67,27.81 51.34,28.47 RELAY1.P$10
  Top 1.27: CON3.P$3 53.74,14.62 53.47,14.61
  Bottom 0.406: v47.12,15.37 v50.93,15.37 | v50.16,25.02 v50.16,27.81
SIGNAL_OUTPUT_A
  Top 0.406: RELAY1.P$4 53.88,27.28 52.58,28.57 52.58,35.18 52.2,35.56
  Top 1.27: CON4.P$1 52.2,35.56 50.99,35.56 C9.P$1
SIGNAL_OUTPUT_B  (via drill 0.3)
  Top 0.406: RELAY1.P$9 53.88,34.06 v53.98,34.16 | v53.98,36.96 53.98,42.56
  Top 1.27: CON4.P$3 53.98,42.56 51.01,42.56 C10.P$1
  Bottom 0.406: v53.98,34.16 v53.98,36.96
SPOOF_EN
  Top 0.254: Q1.P$1 48.52,32.27 48.9,32.64 48.9,36.2 49.4,36.7 49.4,47.37 48.39,48.39 JP2.7
SPOOF_SIGNAL_A  (via drill 0.3)
  Top 0.406: U5.P$14 39.92,27.48 40.77,28.32 v42.55,28.32 | v45.09,28.07 46.36,26.8 v51.18,26.8 | v54.74,26.8 55.5,26.8 56.41,25.88 RELAY1.P$5 56.41,18.82 54.48,16.89 51.94,16.89 51.69,16.64 v51.69,16.38 | R19.P$1 47.37,11.81 47.88,12.32 50.67,12.32 v51.69,13.34
  Bottom 0.406: v42.55,28.32 44.83,28.32 v45.09,28.07 | v51.18,26.8 51.69,26.8 52.45,26.04 53.21,26.04 53.98,26.8 v54.74,26.8 | v51.69,16.38 v51.69,13.34
SPOOF_SIGNAL_B  (via drill 0.3)
  Top 0.406: U5.P$10 42.18,24.88 v42.29,24.77 | v44.83,25.53 45.85,25.53 46.36,26.04 51.69,26.04 v52.71,27.05 | v54.48,28.07 56.01,28.07 56.26,28.32 | RELAY1.P$8 56.41,28.47 56.26,28.32 | R20.P$1 51.22,11.35 v52.2,12.32 | v53.47,16.13 54.99,16.13 57.79,18.92 57.79,26.8 56.26,28.32
  Bottom 0.406: v42.29,24.77 44.07,24.77 v44.83,25.53 | v52.71,27.05 52.96,27.05 53.98,28.07 v54.48,28.07 | v52.2,12.32 52.45,12.57 52.45,15.11 v53.47,16.13
TX_CAN  (via drill 0.3)
  Top 0.254: U2.1 26.16,19.81 25.78,19.43 25.78,18.92 24.38,17.53 U1.1 19.3,17.53 v18.92,17.91 19.18,17.65 | D3.CATHODE 13.59,6.48 14.86,7.75 14.86,15.37 v14.61,15.62
  Bottom 0.254: v14.61,15.62 15.11,15.62 15.62,16.13 15.62,16.89 16.38,17.65 18.67,17.65 v18.92,17.91
V+
  Top 1.27: CON1.P$1 10.92,29.97 17.4,36.45 U4.P$1

### Text on the board
tPlace: NO COM | NO COM NC | GND | SIG / OUT / B | GND | NC | A | +12V | GND | CANH | GND | CANL | SIG / IN / B | GND | PWR | CAN-TX | A | CAN-RX | INT